# EAGLE design mp3player_v5_Laderegler (EAGLE 9.1.2)
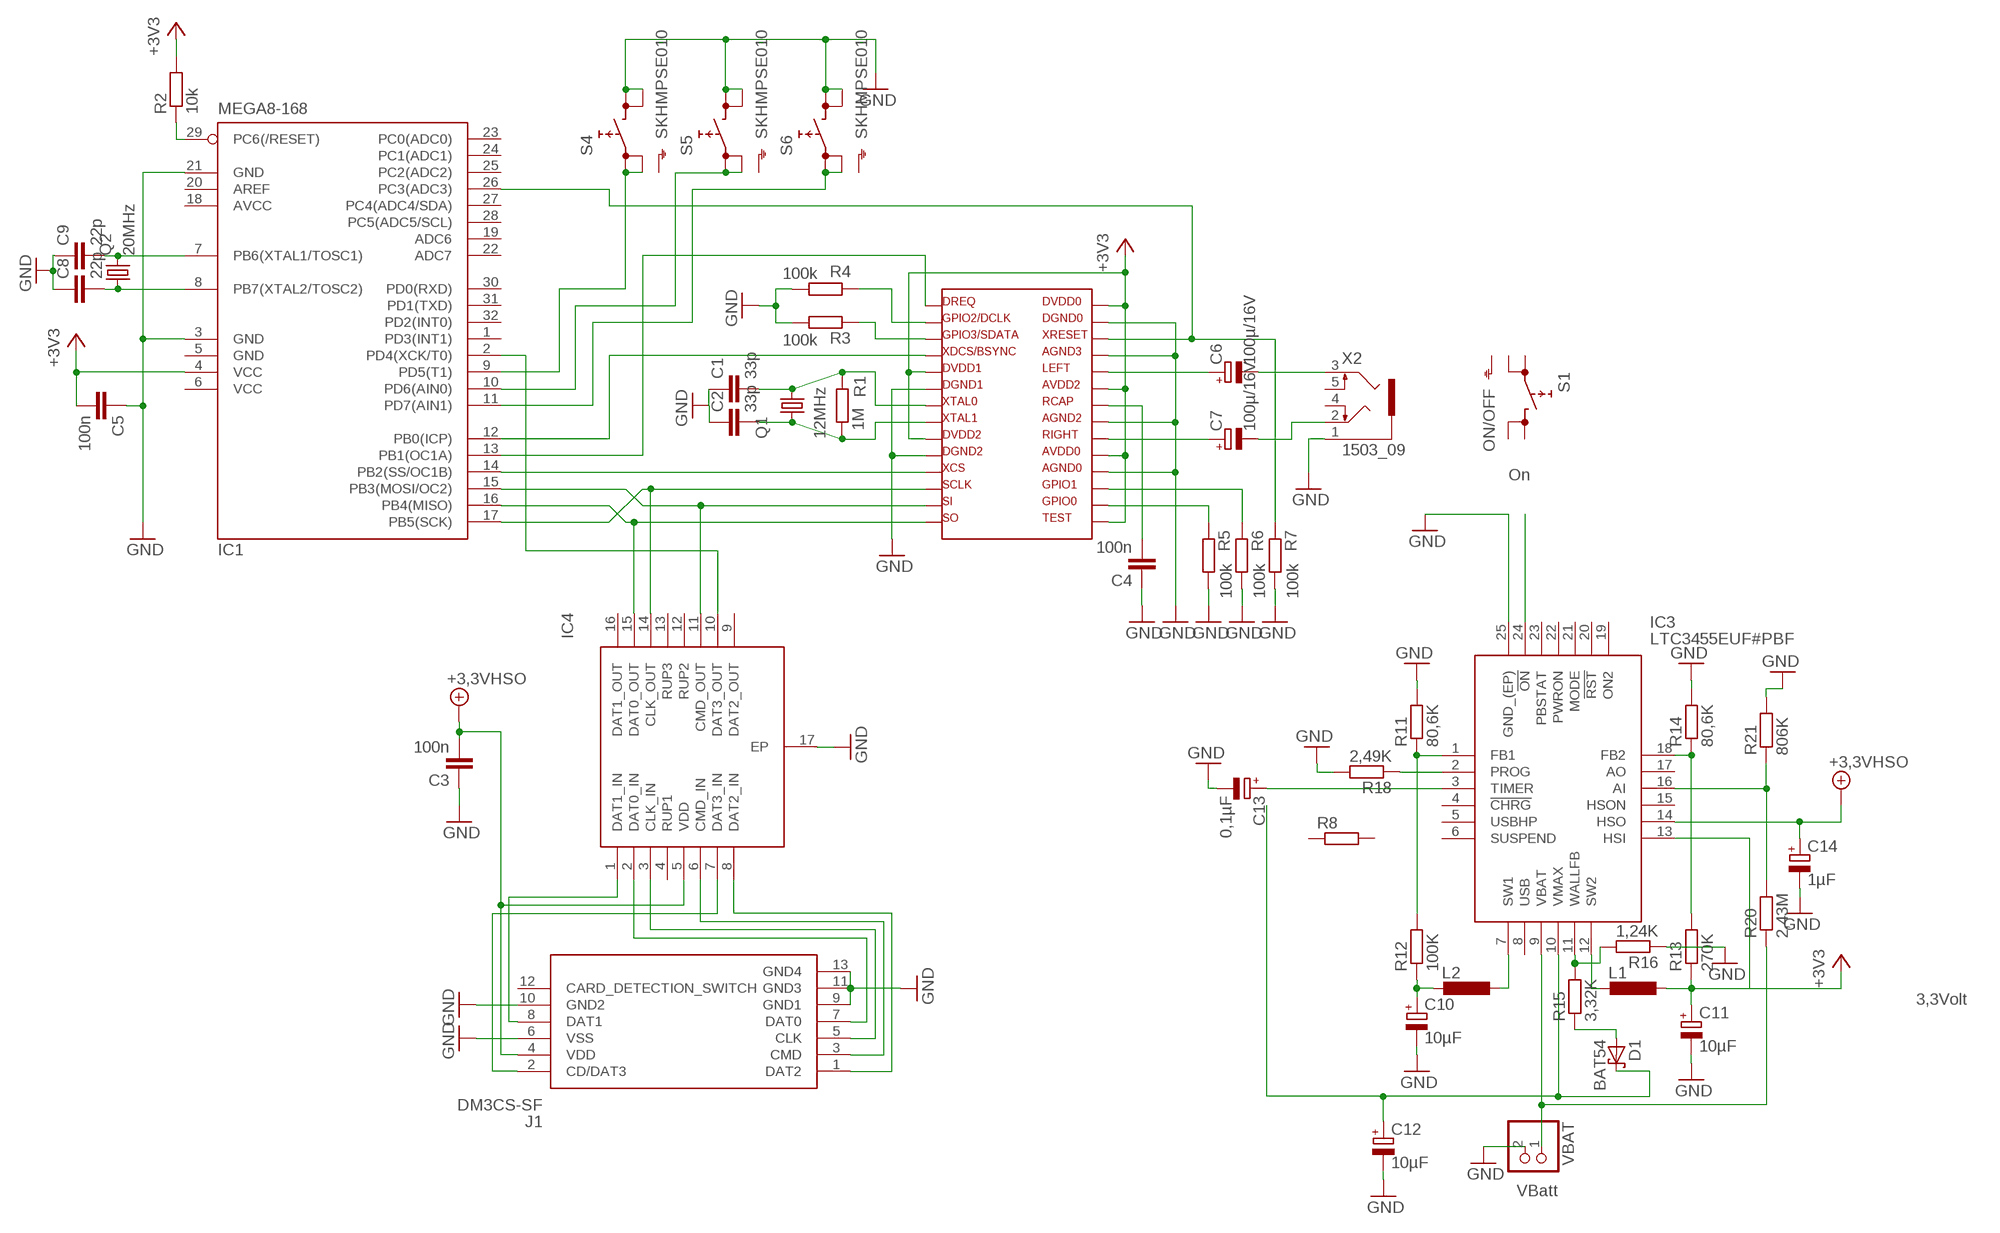
[diagram p0: schematic, sheet 1]

## Parts
C1  33p  C-EUC1206K  [C1206K]
C2  33p  C-EUC1206K  [C1206K]
C3  100n  C-EUC1206K  [C1206K]
C4  100n  C-EUC1206K  [C1206K]
C5  100n  C-EUC1206K  [C1206K]
C6  100µ/16V  CPOL-EUUD-6,3X7,7  [UD-6,3X7,7_NICHICON]
C7  100µ/16V  CPOL-EUUD-6,3X7,7  [UD-6,3X7,7_NICHICON]
C8  22p  C-EUC1206K  [C1206K]
C9  22p  C-EUC1206K  [C1206K]
C10  10µF  CPOL-EU153CLV-0505  [153CLV-0505]
C11  10µF  CPOL-EU153CLV-0505  [153CLV-0505]
C12  10µF  CPOL-EU153CLV-0505  [153CLV-0505]
C13  0,1µF  CPOL-EUB/3528-21W  [B/3528-21W]
C14  1µF  CPOL-EUB/3528-21W  [B/3528-21W]
D1  BAT54  [SOT23]
IC1  MEGA8-168  MEGA8-AI  [TQFP32-08]
IC2  VS1011  [SOIC-28]
IC3  LTC3455EUF#PBF  [QFN50P400X400X80-25N]
IC4  ECLAMP2410P.TCT  [SON50P160X400X65-17N]
J1  DM3CS-SF  [DM3CS-SF]
L1  L-EUL2825P  [L2825P]
L2  L-EUL2825P  [L2825P]
Q1  12MHz  CRYSTALHC49UP  [HC49UP]
Q2  20MHz  CRYSTALHC49UP  [HC49UP]
R1  1M  R-EU_R0805  [R0805]
R2  10k  R-EU_R0805  [R0805]
R3  100k  R-EU_R0805  [R0805]
R4  100k  R-EU_R0805  [R0805]
R5  100k  R-EU_R0805  [R0805]
R6  100k  R-EU_R0805  [R0805]
R7  100k  R-EU_R0805  [R0805]
R8  R-EU_R0805  [R0805]
R11  80,6K  R-EU_R0805  [R0805]
R12  100K  R-EU_M1206  [M1206]
R13  270K  R-EU_M1206  [M1206]
R14  80,6K  R-EU_R0805  [R0805]
R15  3,32K  R-EU_M1206  [M1206]
R16  1,24K  R-EU_M1206  [M1206]
R18  2,49K  R-EU_R0805  [R0805]
R20  2,43M  R-EU_M1206  [M1206]
R21  806K  R-EU_R0805  [R0805]
S1  ON/OFF  SKHMPSE010  [SKHMPXE010]
S4  SKHMPSE010  [SKHMPXE010]
S5  SKHMPSE010  [SKHMPXE010]
S6  SKHMPSE010  [SKHMPXE010]
VBAT  PINHD-1X2  [1X02]
X2  1503_09  [1503_09]

## Nets
+3,3VHSO: C3.2 C14.+ IC3.14(HSO) IC4.5(VDD) J1.4(VDD)
+3V3: C5.2 C11.+ IC1.4(VCC) IC2.5 IC2.9 IC2.15 IC2.19 IC2.23 IC2.28 IC3.13(HSI) L1.1 R2.2 R13.1
GND: C1.1 C2.1 C3.1 C4.1 C5.1 C8.1 C9.1 C10.- C11.- C12.- C13.- C14.- IC1.3(GND) IC1.21(GND) IC2.6 IC2.10 IC2.18 IC2.21 IC2.25 IC2.27 IC3.25(GND_(EP)) IC4.17(EP) J1.6(VSS) J1.9(GND1) J1.10(GND2) J1.11(GND3) J1.13(GND4) R3.2 R4.2 R5.2 R6.2 R7.2 R11.2 R14.2 R16.1 R18.2 R21.2 S4.3(2.1) S4.4(2.2) S5.3(2.1) S5.4(2.2) S6.3(2.1) S6.4(2.2) VBAT.2 X2.1
N$1: IC1.17(PB5(SCK)) IC2.12 IC4.14(CLK_OUT)
N$2: IC1.16(PB4(MISO)) IC2.14 IC4.15(DAT0_OUT)
N$3: IC1.15(PB3(MOSI/OC2)) IC2.13 IC4.11(CMD_OUT)
N$4: IC1.14(PB2(SS/OC1B)) IC2.11
N$5: IC1.2(PD4(XCK/T0)) IC4.10(DAT3_OUT)
N$6: C2.2 IC2.8 Q1.1 R1.1
N$7: IC1.12(PB0(ICP)) IC2.4
N$8: C4.2 IC2.22
N$9: IC2.3 R3.1
N$10: C1.2 IC2.7 Q1.2 R1.2
N$11: IC2.2 R4.1
N$12: IC1.9(PD5(T1)) S4.1(1.1) S4.2(1.2)
N$13: IC2.17 R6.1
N$14: IC2.16 R5.1
N$15: IC1.13(PB1(OC1A)) IC2.1
N$16: IC1.10(PD6(AIN0)) S5.1(1.1) S5.2(1.2)
N$17: IC1.26(PC3(ADC3)) IC2.26 R7.1
N$18: IC1.29(PC6(/RESET)) R2.1
N$19: C7.+ IC2.20
N$20: C6.+ IC2.24
N$21: IC1.11(PD7(AIN1)) S6.1(1.1) S6.2(1.2)
N$22: C6.- X2.3
N$23: C7.- X2.2
N$24: C8.2 IC1.8(PB7(XTAL2/TOSC2)) Q2.1
N$25: C9.2 IC1.7(PB6(XTAL1/TOSC1)) Q2.2
N$26: IC4.1(DAT1_IN) J1.8(DAT1)
N$27: IC4.8(DAT2_IN) J1.1(DAT2)
N$28: IC3.12(SW2) L1.2
N$29: IC4.7(DAT3_IN) J1.2(CD/DAT3)
N$30: IC4.2(DAT0_IN) J1.7(DAT0)
N$31: IC4.3(CLK_IN) J1.5(CLK)
N$32: IC4.6(CMD_IN) J1.3(CMD)
N$40: IC3.24(!ON)
N$41: IC3.7(SW1) L2.1
N$42: IC3.1(FB1) R11.1 R12.2
N$43: C10.+ L2.2 R12.1
N$44: IC3.18(FB2) R13.2 R14.1
N$45: IC3.9(VBAT) R20.1 VBAT.1
N$46: C12.+ D1.3(C) IC3.10(VMAX)
N$47: IC3.11(WALLFB) R15.2 R16.2
N$48: D1.1(A) R15.1
N$51: IC3.2(PROG) R18.1
N$52: C13.+ IC3.3(TIMER)
N$55: IC3.16(AI) R20.2 R21.1
Unconnected: IC1.1(PD3(INT1)) IC1.19(ADC6) IC1.20(AREF) IC1.22(ADC7) IC1.23(PC0(ADC0)) IC1.24(PC1(ADC1)) IC1.25(PC2(ADC2)) IC1.27(PC4(ADC4/SDA)) IC1.28(PC5(ADC5/SCL)) IC1.30(PD0(RXD)) IC1.31(PD1(TXD)) IC1.32(PD2(INT0)) IC3.4(!CHRG) IC3.5(USBHP) IC3.6(SUSPEND) IC3.8(USB) IC3.15(HSON) IC3.17(AO) IC3.19(ON2) IC3.20(!RST) IC3.21(MODE) IC3.22(PWRON) IC3.23(PBSTAT) IC4.4(RUP1) IC4.9(DAT2_OUT) IC4.12(RUP2) IC4.13(RUP3) IC4.16(DAT1_OUT) J1.12(CARD_DETECTION_SWITCH) R8.1 R8.2 S1.1(1.1) S1.2(1.2) S1.3(2.1) S1.4(2.2) S1.5(SH) S4.5(SH) S5.5(SH) S6.5(SH) X2.4 X2.5

## Notes on the sheet
- On
- 3,3Volt
- VBatt

## Power pins joined to a net without a drawn wire
AVCC: IC1.18(AVCC)
GND: IC1.5(GND)
VCC: IC1.6(VCC)

## Library data of the parts
C1-C5 = rcl:C-EU: CAPACITOR, European symbol
C6 C7 C10-C14 = rcl:CPOL-EU: POLARIZED CAPACITOR, European symbol
C8 C9 = rcl:C-EU: CAPACITOR, European symbol; SPICEPREFIX: C
D1 = diode:BAT54: Schottky Diodes Source: Fairchild .. BAT54.pdf
IC1 = atmel:MEGA8: MICROCONTROLLER 8 Kbytes FLASH, 1 kbytes SRAM, 512 bytes EEPROM, USART, 6-channel 10 bit ADC, 2-channel 8 bit ADC Pin compatible with Atmega48, ATMega88, ATMega168 Source: avr.lbr; MPN: ATMEGA8-16AU; OC_FARNELL: 9171371; OC_NEWARK: 73M8863
IC2 = vs10xx:VS1011
IC3 = SamacSys_Parts:LTC3455EUF#PBF: LTC3455 power manager & dc-dc converter LTC3455EUF#PBF, Battery Charge Controller, Lithium-Ion, 24-Pin QFN EP Source: Datasheet <http://cds.linear.com/docs/en/datasheet/3455fc.pdf>; ARROW_PART_NUMBER: LTC3455EUF#PBF; ARROW_PRICE/STOCK: https://www.arrow.com/en/products/ltc3455eufpbf/linear-technology; DESCRIPTION: LTC3455 power manager & dc-dc converter LTC3455EUF#PBF, Battery Charge Controller, Lithium-Ion, 24-Pin QFN EP; HEIGHT: 0.8mm; MANUFACTURER_NAME: Linear Technology; MANUFACTURER_PART_NUMBER: LTC3455EUF#PBF; RS_PART_NUMBER: 1533383; RS_PRICE/STOCK: http://at.rs-online.com/web/p/products/1533383
IC4 = SamacSys_Parts:ECLAMP2410P.TCT: EClamp ESD-EMI Protect T-Flash/MicroSD Semtech ECLAMP2410P.TCT, Hex Bi-Directional EMI Filter & ESD Protector, 16-Pin SLP EP Source: Datasheet <http://www.semtech.com/images/datasheet/eclamp2410p.pdf>; ARROW_PART_NUMBER: ECLAMP2410P.TCT; ARROW_PRICE/STOCK: https://www.arrow.com/en/products/eclamp2410p.tct/semtech; DESCRIPTION: EClamp ESD-EMI Protect T-Flash/MicroSD Semtech ECLAMP2410P.TCT, Hex Bi-Directional EMI Filter & ESD Protector, 16-Pin SLP EP; HEIGHT: 0.65mm; MANUFACTURER_NAME: SEMTECH; MANUFACTURER_PART_NUMBER: ECLAMP2410P.TCT; RS_PART_NUMBER: 6910638; RS_PRICE/STOCK: http://uk.rs-online.com/web/p/products/6910638
J1 = SamacSys_Parts:DM3CS-SF: MicroSD card connector, push-pull type MicroSD card connector, push-pull type Source: Datasheet <http://docs-europe.electrocomponents.com/webdocs/118f/0900766b8118f8bb.pdf>; ARROW_PART_NUMBER: DM3CS-SF; ARROW_PRICE/STOCK: https://www.arrow.com/en/products/dm3cs-sf/hirose-electric; DESCRIPTION: MicroSD card connector, push-pull type MicroSD card connector, push-pull type; HEIGHT: mm; MANUFACTURER_NAME: Hirose; MANUFACTURER_PART_NUMBER: DM3CS-SF; RS_PART_NUMBER: 1664833; RS_PRICE/STOCK: http://uk.rs-online.com/web/p/products/1664833
L1 L2 = rcl:L-EU: INDUCTOR, European symbol; SPICEPREFIX: L
Q1 = crystal:CRYSTAL: CRYSTAL
Q2 = crystal:CRYSTAL: CRYSTAL; OC_FARNELL: unknown; OC_NEWARK: unknown
R1-R8 R11 R14 R18 R21 = rcl:R-EU_: RESISTOR, European symbol; SPICEPREFIX: R
R12 R13 R15 R16 R20 = rcl:R-EU_: RESISTOR, European symbol
S1 S4-S6 = switch:SKHMP*E010: 6.2 X 6.5mm TACT Switch (SMD) Source: http://www3.alps.co.jp/WebObjects/catalog.woa/PDF/E/Switch/Tact/SKHM/SKHM.PDF
VBAT = pinhead:PINHD-1X2: PIN HEADER
X2 = con-lumberg:1503_09: Jack connectors according to JISC 6560, 3.5 mm Klinkeneinbaukupplung nach JISC 6560, 3,5 mm, 3-polig/ stereo, abgewinkelte Ausführung, mit 2 Öffnern und Lötaugen, für Leiterplatten Rückseitenmontage Source: http://www.lumberg.com/Produkte/PDFs/1503_09.pdf

## Board
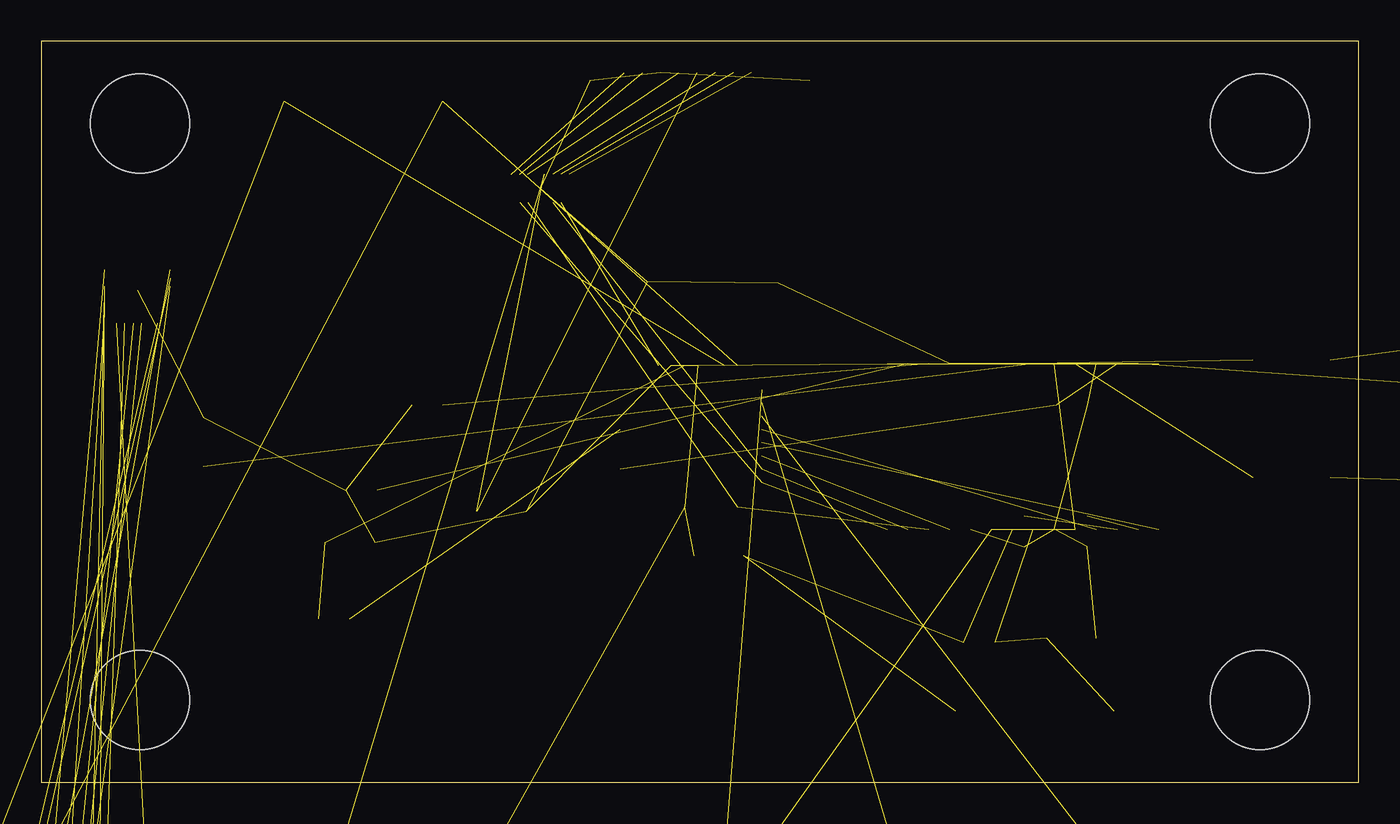
[diagram p1: board, top side]
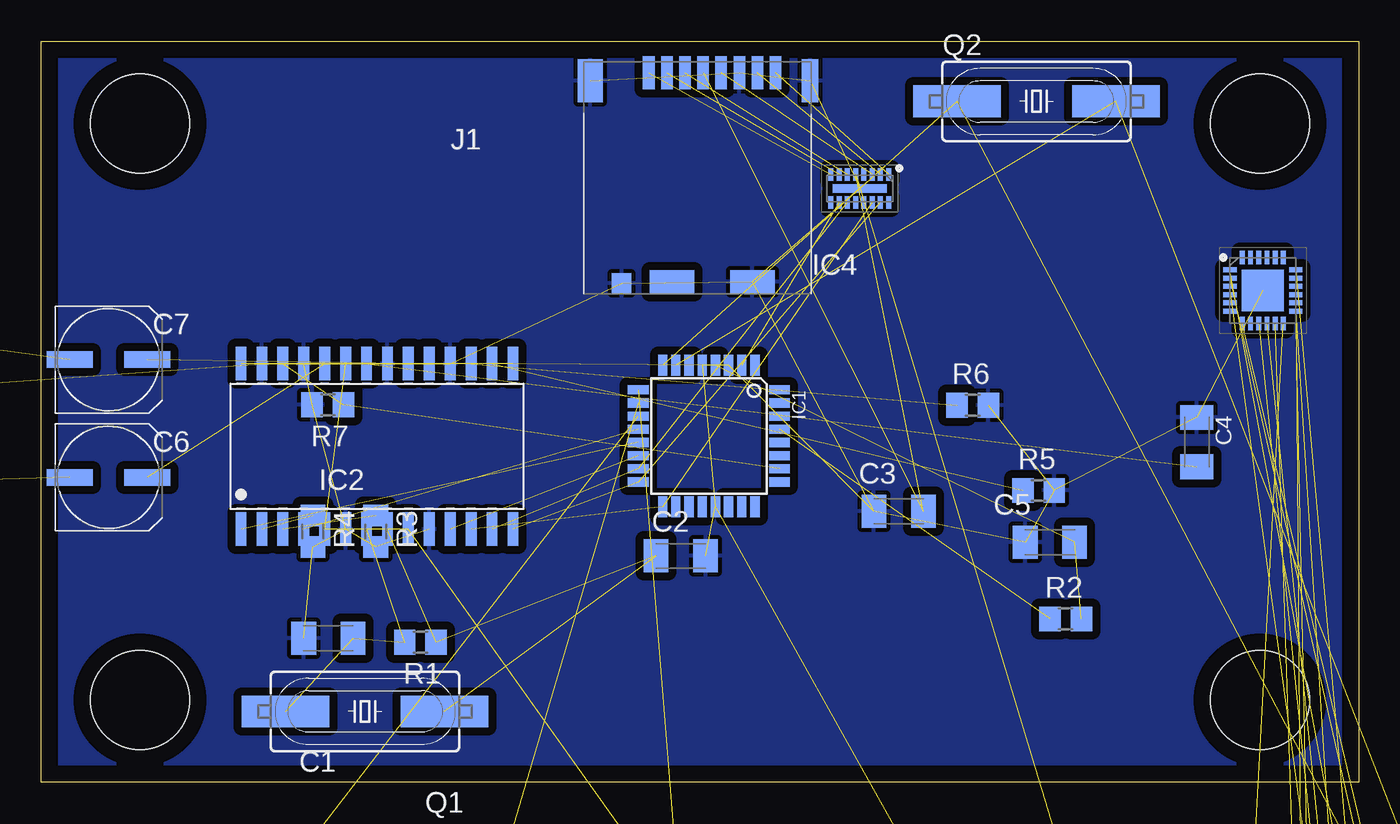
[diagram p2: board, bottom side, seen from below]

Size 80 x 45 mm. Coordinates in mm from the lower left corner, seen from the top.
Outline: 0,0 80,0 80,45 0,45 0,0
Copper layers (1*16): Top 0.035mm / dielectric 1.5mm / Bottom 0.035mm
Design rules "default *": minimum track width 16mil, minimum drill 24mil, track to track 20mil, track to pad 20mil, pad to pad 8mil, via to via 8mil, smd to smd 20mil, copper to edge 40mil, drill to drill 8mil, minimum pad ring 10mil, minimum via ring 8mil, stop-mask expansion 4mil, vias tented up to drill 0mil, thermal gap 10mil
Holes 6 mm at 6,40 74,40 74,5 6,5

### Footprints (pad centres in the part's own frame; a part is rotated, then mirrored left to right if it is on the bottom)
C1206K = smd 1.5 x 2: 1 -1.5,0; 2 1.5,0
UD-6,3X7,7_NICHICON = smd 2.8 x 1: + 2.35,0; - -2.35,0
153CLV-0505 = smd 3 x 1.6: + 2.2,0; - -2.2,0
B/3528-21W = smd 2.15 x 1.8: + 1.625,0; - -1.625,0
SOT23 = smd 1 x 1.4: 1 -0.95,-1.1; 2 0.95,-1.1; 3 0,1.1
TQFP32-08 = smd 1.27 x 0.559: 1 -4.293,2.8; 2 -4.293,2; 3 -4.293,1.2; 4 -4.293,0.4; 5 -4.293,-0.4; 6 -4.293,-1.2; 7 -4.293,-2; 8 -4.293,-2.8; 17 4.293,-2.8; 18 4.293,-2; 19 4.293,-1.2; 20 4.293,-0.4; 21 4.293,0.4; 22 4.293,1.2; 23 4.293,2; 24 4.293,2.8 | smd 0.559 x 1.27: 9 -2.8,-4.293; 10 -2,-4.293; 11 -1.2,-4.293; 12 -0.4,-4.293; 13 0.4,-4.293; 14 1.2,-4.293; 15 2,-4.293; 16 2.8,-4.293; 25 2.8,4.293; 26 2,4.293; 27 1.2,4.293; 28 0.4,4.293; 29 -0.4,4.293; 30 -1.2,4.293; 31 -2,4.293; 32 -2.8,4.293
SOIC-28 = smd 0.66 x 2.032: 1 -6.985,-5.029; 2 -5.715,-5.029; 3 -4.445,-5.029; 4 -3.175,-5.029; 5 -1.905,-5.029; 6 -0.635,-5.029; 7 0.635,-5.029; 8 1.905,-5.029; 9 3.175,-5.029; 10 4.445,-5.029; 11 5.715,-5.029; 12 6.985,-5.029; 13 8.255,-5.029; 14 9.525,-5.029; 15 9.525,5.029; 16 8.255,5.029; 17 6.985,5.029; 18 5.715,5.029; 19 4.445,5.029; 20 3.175,5.029; 21 1.905,5.029; 22 0.635,5.029; 23 -0.635,5.029; 24 -1.905,5.029; 25 -3.175,5.029; 26 -4.445,5.029; 27 -5.715,5.029; 28 -6.985,5.029
QFN50P400X400X80-25N = smd 0.8 x 0.3: 1 -2,1.25; 2 -2,0.75; 3 -2,0.25; 4 -2,-0.25; 5 -2,-0.75; 6 -2,-1.25; 13 2,-1.25; 14 2,-0.75; 15 2,-0.25; 16 2,0.25; 17 2,0.75; 18 2,1.25 | smd 0.3 x 0.8: 7 -1.25,-2; 8 -0.75,-2; 9 -0.25,-2; 10 0.25,-2; 11 0.75,-2; 12 1.25,-2; 19 1.25,2; 20 0.75,2; 21 0.25,2; 22 -0.25,2; 23 -0.75,2; 24 -1.25,2 | smd 2.55 x 2.55: 25 0,0
SON50P160X400X65-17N = smd 0.75 x 0.3: 1 -0.85,1.75; 2 -0.85,1.25; 3 -0.85,0.75; 4 -0.85,0.25; 5 -0.85,-0.25; 6 -0.85,-0.75; 7 -0.85,-1.25; 8 -0.85,-1.75; 9 0.85,-1.75; 10 0.85,-1.25; 11 0.85,-0.75; 12 0.85,-0.25; 13 0.85,0.25; 14 0.85,0.75; 15 0.85,1.25; 16 0.85,1.75 | smd 0.5 x 3.3: 17 0,0
DM3CS-SF = smd 0.7 x 2: 1 0,0; 2 -1.1,0; 3 -2.2,0; 4 -3.3,0; 5 -4.4,0; 6 -5.5,0; 7 -6.6,0; 8 -7.7,0 | smd 1 x 2.6: 9 -9.8,0.5 | smd 1.5 x 2.6: 10 3.55,0.5 | smd 1.2 x 1.2: 11 1.65,12.8 | smd 2.7 x 1.4: 12 -1.4,12.7; 13 -6.3,12.7
L2825P = smd 1.4 x 2.4: 1 -1.2,0; 2 1.2,0
HC49UP = smd 5.334 x 1.93: 1 -4.826,0; 2 4.826,0
R0805 = smd 1.3 x 1.5: 1 -0.95,0; 2 0.95,0
M1206 = smd 1.6 x 2: 1 -1.4,0; 2 1.4,0
SKHMPXE010 = smd 1.6 x 1.4: 1 -4.2,2.25; 2 4.2,2.25; 3 -4.2,-2.25; 4 4.2,-2.25; 5 4.2,0
1X02 = drill 1.016 long: 1 -1.27,0; 2 1.27,0
1503_09 = drill 0.8 pad 1.2 long: 1 0,-2.1; 2 -4.55,-5.4; 3 5.05,-9.9; 4 -4,-13.1; 5 2.65,-8.5

### Placement (x,y rotation side)
C1  62.56,8.75 0 bottom
C2  41.16,13.75 180 bottom
C3  27.94,16.46 0 bottom
C4  9.83,20.66 270 bottom
C5  18.76,14.58 0 bottom
C6  75.91,18.52 0 bottom
C7  75.91,25.66 0 bottom
C8  -16.67,-39.37 0 bottom  (outside the outline)
C9  -16.67,-43.18 0 bottom  (outside the outline)
C10  -15.24,-49.21 0 bottom  (outside the outline)
C11  -7.62,-49.21 0 bottom  (outside the outline)
C12  0,-49.21 0 bottom  (outside the outline)
C13  -2.38,-57.47 0 bottom  (outside the outline)
C14  3.65,-57.47 0 bottom  (outside the outline)
D1  -9.21,-57.78 0 bottom  (outside the outline)
IC1  39.47,21.04 270 bottom
IC2  60.88,20.4 0 bottom
IC3  5.83,29.86 0 bottom
IC4  30.3,36.06 270 bottom
J1  43.11,43.09 180 bottom
L1  10,-50 0 bottom  (outside the outline)
L2  -14.92,-60.17 0 bottom  (outside the outline)
Q1  60.34,4.3 180 bottom
Q2  19.57,41.34 0 bottom
R1  56.98,8.51 180 bottom
R2  17.8,9.93 0 bottom
R3  59.69,15.24 270 bottom
R4  63.5,15.24 270 bottom
R5  19.44,17.72 0 bottom
R6  23.44,22.89 0 bottom
R7  62.59,22.93 180 bottom
R8  76,-36 0 bottom  (outside the outline)
R11  -9.68,-66.67 0 bottom  (outside the outline)
R12  -10,-72.87 0 bottom  (outside the outline)
R13  -3.97,-72.87 0 bottom  (outside the outline)
R14  -3.17,-66.67 0 bottom  (outside the outline)
R15  3.33,-66.67 0 bottom  (outside the outline)
R16  9.84,-66.67 0 bottom  (outside the outline)
R18  -16.51,-72.87 0 bottom  (outside the outline)
R20  -16.51,-66.67 0 bottom  (outside the outline)
R21  2.06,-72.87 0 bottom  (outside the outline)
S1  88,-58 0 bottom  (outside the outline)
S4  44.4,-22.85 0 bottom  (outside the outline)
S5  56.4,-7.85 0 bottom  (outside the outline)
S6  69.4,-7.85 0 bottom  (outside the outline)
VBAT  -4.13,-85.09 0 top  (outside the outline)
X2  99.38,23.23 270 top  (outside the outline)

### Tracks (layer width: path | path; a pad name or v marks a point on that pad's centre or on a via)
+3,3VHSO  (4 unrouted)
+3V3  (12 unrouted)
GND  (45 unrouted)
  pour Bottom: 0,45 0,-0.16 80,-0.16 80,45
N$1  (2 unrouted)
N$2  (2 unrouted)
N$3  (2 unrouted)
N$4  (1 unrouted)
N$5  (1 unrouted)
N$6  (3 unrouted)
N$7  (1 unrouted)
N$8  (1 unrouted)
N$9  (1 unrouted)
N$10  (3 unrouted)
N$11  (1 unrouted)
N$12  (2 unrouted)
N$13  (1 unrouted)
N$14  (1 unrouted)
N$15  (1 unrouted)
N$16  (2 unrouted)
N$17  (2 unrouted)
N$18  (1 unrouted)
N$19  (1 unrouted)
N$20  (1 unrouted)
N$21  (2 unrouted)
N$22  (1 unrouted)
N$23  (1 unrouted)
N$24  (2 unrouted)
N$25  (2 unrouted)
N$26  (1 unrouted)
N$27  (1 unrouted)
N$28  (1 unrouted)
N$29  (1 unrouted)
N$30  (1 unrouted)
N$31  (1 unrouted)
N$32  (1 unrouted)
N$41  (1 unrouted)
N$42  (2 unrouted)
N$43  (2 unrouted)
N$44  (2 unrouted)
N$45  (2 unrouted)
N$46  (2 unrouted)
N$47  (2 unrouted)
N$48  (1 unrouted)
N$51  (1 unrouted)
N$52  (1 unrouted)
N$55  (2 unrouted)

### Text on the board
tNames: HTL-Saalfelden | MP3-Player